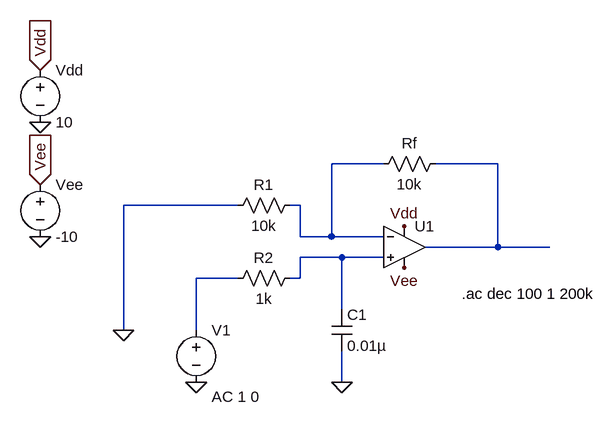
[diagram p0: schematic 1st order.asc]
1st order.asc, the LTspice schematic file:
Version 4
SHEET 1 1764 680
WIRE 384 96 304 96
WIRE 560 96 464 96
WIRE 160 160 -16 160
WIRE 256 160 240 160
WIRE 256 208 256 160
WIRE 304 208 304 96
WIRE 304 208 256 208
WIRE 384 208 304 208
WIRE 560 224 560 96
WIRE 560 224 448 224
WIRE 640 224 560 224
WIRE 320 240 256 240
WIRE 384 240 320 240
WIRE 160 272 96 272
WIRE 256 272 256 240
WIRE 256 272 240 272
WIRE 320 320 320 240
WIRE -16 352 -16 160
WIRE 96 352 96 272
WIRE 320 432 320 384
FLAG -16 352 0
FLAG 96 432 0
FLAG -144 -48 Vdd
IOPIN -144 -48 In
FLAG -144 128 Vee
IOPIN -144 128 In
FLAG -144 32 0
FLAG -144 208 0
FLAG 416 192 Vdd
FLAG 416 256 Vee
FLAG 320 432 0
SYMBOL Voltage 96 336 R0
WINDOW 123 24 118 Left 2
SYMATTR Value2 AC 1 0
SYMATTR InstName V1
SYMATTR Value ""
SYMBOL Res 256 144 R90
WINDOW 0 0 56 VBottom 2
WINDOW 3 32 56 VTop 2
SYMATTR InstName R1
SYMATTR Value 10k
SYMBOL Res 480 80 R90
WINDOW 0 0 56 VBottom 2
WINDOW 3 32 56 VTop 2
SYMATTR InstName Rf
SYMATTR Value 10k
SYMBOL Res 256 256 R90
WINDOW 0 0 56 VBottom 2
WINDOW 3 32 56 VTop 2
SYMATTR InstName R2
SYMATTR Value 1k
SYMBOL OpAmps/UniversalOpAmp 416 224 R0
SYMATTR InstName U1
SYMBOL Voltage -144 -64 R0
SYMATTR InstName Vdd
SYMATTR Value 10
SYMBOL Voltage -144 112 R0
SYMATTR InstName Vee
SYMATTR Value -10
SYMBOL Cap 304 320 R0
SYMATTR InstName C1
SYMATTR Value 0.01µ
TEXT 504 296 Left 2 !.ac dec 100 1 200k

The netlist it stands for:
* 1st order.asc
V1 N004 0 AC 1 0
R1 N001 0 10k
Rf N002 N001 10k
R2 N003 N004 1k
XU1 N003 N001 Vdd Vee N002 level1 Avol=1Meg GBW=10Meg Vos=0 En=0 Enk=0 In=0 Ink=0 Rin=500Meg  ; pins In+ In- V+ V- OUT
Vdd Vdd 0 10
Vee Vee 0 -10
C1 N003 0 0.01µ
.ac dec 100 1 200k
.lib UniversalOpAmp1.lib
.backanno
.end